# Altium project DRV8701_MOTOR_BOARD.PrjPcb
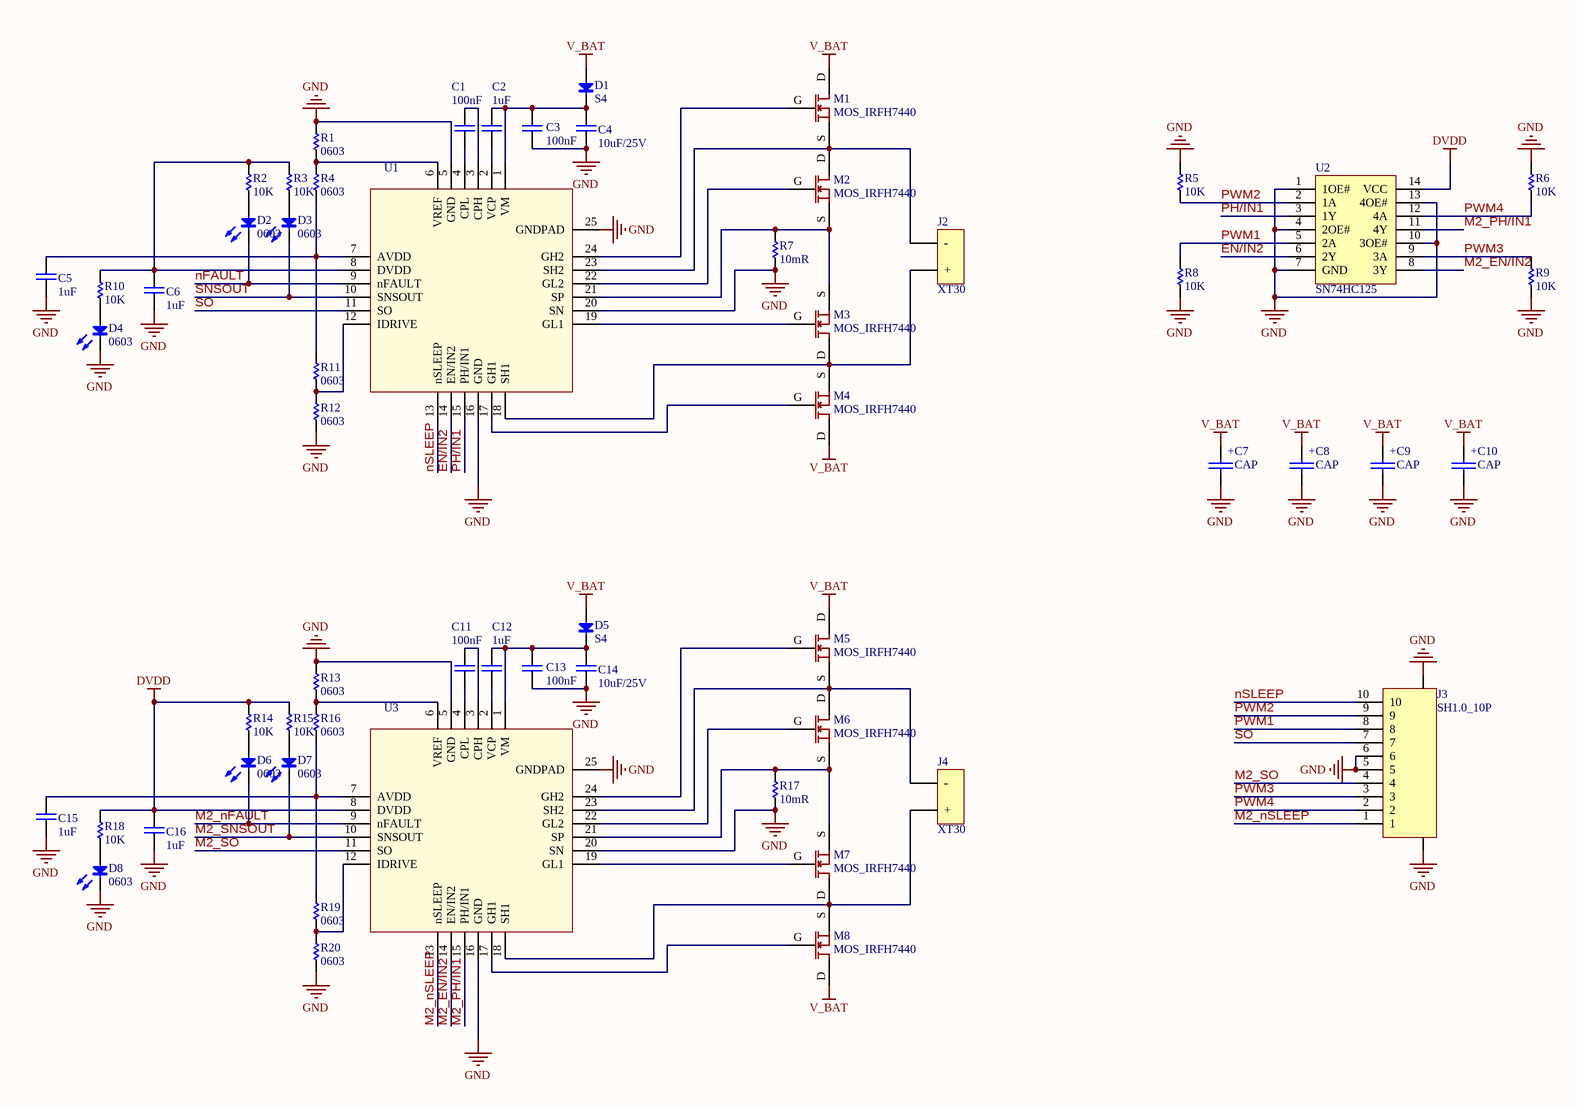
[diagram p0: Sheet1.SchDoc]
1 sheet, 58 parts. Net scope: global (net labels, ports and power ports of the same name join across sheets).
Board file: PCB1.PcbDoc

## Sheet Sheet1.SchDoc
size A3; SheetNumber: 1; SheetTotal: 1

### Parts
C1  100nF  [0603C]
C2  1uF  [0603C]
C3  100nF  [0603C]
C4  10uF/25V  [0805C]
C5  1uF  [0603C]
C6  1uF  [0603C]
C7  CAP  [CAP-8*11.5]
C8  CAP  [CAP-8*11.5]
C9  CAP  [CAP-8*11.5]
C10  CAP  [CAP-8*11.5]
C11  100nF  [0603C]
C12  1uF  [0603C]
C13  100nF  [0603C]
C14  10uF/25V  [0805C]
C15  1uF  [0603C]
C16  1uF  [0603C]
D1  S4  [SOD-123]
D2  0603  [0603-LED]
D3  0603  [0603-LED]
D4  0603  [0603-LED]
D5  S4  [SOD-123]
D6  0603  [0603-LED]
D7  0603  [0603-LED]
D8  0603  [0603-LED]
J2  XT30  [AMASS_XT30_M]
J3  SH1.0_10P  [SH1.0_10P]
J4  XT30  [AMASS_XT30_M]
M1  MOS_IRFH7440  [MOS_IRFH7440]
M2  MOS_IRFH7440  [MOS_IRFH7440]
M3  MOS_IRFH7440  [MOS_IRFH7440]
M4  MOS_IRFH7440  [MOS_IRFH7440]
M5  MOS_IRFH7440  [MOS_IRFH7440]
M6  MOS_IRFH7440  [MOS_IRFH7440]
M7  MOS_IRFH7440  [MOS_IRFH7440]
M8  MOS_IRFH7440  [MOS_IRFH7440]
R1  0603  [0603R]
R2  10K  [0603R]
R3  10K  [0603R]
R4  0603  [0603R]
R5  10K  [0603R]
R6  10K  [0603R]
R7  10mR  [2512R]
R8  10K  [0603R]
R9  10K  [0603R]
R10  10K  [0603R]
R11  0603  [0603R]
R12  0603  [0603R]
R13  0603  [0603R]
R14  10K  [0603R]
R15  10K  [0603R]
R16  0603  [0603R]
R17  10mR  [2512R]
R18  10K  [0603R]
R19  0603  [0603R]
R20  0603  [0603R]
U1  DRV8701  [DRV8701]  (value not drawn)
U2  SN74HC125  [TSSOP-14_L5.0-W4.4-P0.65-LS6.5-BL]
U3  DRV8701  [DRV8701]  (value not drawn)

### Nets
DVDD: C16.2 R14.1 R15.1 R18.1 U2.14(VCC) U3.8(DVDD)
GND: C3.2 C4.1 C5.2 C6.1 C7.2 C8.2 C9.2 C10.2 C13.2 C14.1 C15.2 C16.1 D4.2 D8.2 J3.5 J3.6 J3.11 J3.12 R1.2 R5.1 R6.2 R7.2 R8.2 R9.2 R12.2 R13.2 R17.2 R20.2 U1.5(GND) U1.16(GND) U1.20(SN) U1.25(GNDPAD) U2.1(1OE#) U2.4(2OE#) U2.7(GND) U2.10(3OE#) U2.13(4OE#) U3.5(GND) U3.16(GND) U3.20(SN) U3.25(GNDPAD)
V_BAT: C7.1 C8.1 C9.1 C10.1 D1.A D5.A M1.D M4.D M5.D M8.D
EN/IN2: U1.14(EN/IN2) U2.6(2Y)
M2_EN/IN2: U2.8(3Y) U3.14(EN/IN2)
M2_nFAULT: D6.2 U3.9(nFAULT)
M2_nSLEEP: J3.1 U3.13(nSLEEP)
M2_PH/IN1: U2.11(4Y) U3.15(PH/IN1)
M2_SNSOUT: D7.2 U3.10(SNSOUT)
M2_SO: J3.4 U3.11(SO)
nFAULT: D2.2 U1.9(nFAULT)
nSLEEP: J3.10 U1.13(nSLEEP)
PH/IN1: U1.15(PH/IN1) U2.3(1Y)
PWM1: J3.8 R8.1 U2.5(2A)
PWM2: J3.9 R5.2 U2.2(1A)
PWM3: J3.3 R9.1 U2.9(3A)
PWM4: J3.2 R6.1 U2.12(4A)
SNSOUT: D3.2 U1.10(SNSOUT)
SO: J3.7 U1.11(SO)
NetC1_1: C1.1 U1.3(CPH)
NetC1_2: C1.2 U1.4(CPL)
NetC2_1: C2.1 C3.1 C4.2 D1.K U1.1(VM)
NetC2_2: C2.2 U1.2(VCP)
NetC5_1: C5.1 R4.1 R11.1 U1.7(AVDD)
NetC6_2: C6.2 R2.1 R3.1 R10.1 U1.8(DVDD)
NetC11_1: C11.1 U3.3(CPH)
NetC11_2: C11.2 U3.4(CPL)
NetC12_1: C12.1 C13.1 C14.2 D5.K U3.1(VM)
NetC12_2: C12.2 U3.2(VCP)
NetC15_1: C15.1 R16.1 R19.1 U3.7(AVDD)
NetD2_1: D2.1 R2.2
NetD3_1: D3.1 R3.2
NetD4_1: D4.1 R10.2
NetD6_1: D6.1 R14.2
NetD7_1: D7.1 R15.2
NetD8_1: D8.1 R18.2
NetJ2_1: J2.1(+) M3.D M4.S U1.18(SH1)
NetJ2_2: J2.2(-) M1.S M2.D U1.23(SH2)
NetJ4_1: J4.1(+) M7.D M8.S U3.18(SH1)
NetJ4_2: J4.2(-) M5.S M6.D U3.23(SH2)
NetM1_G: M1.G U1.24(GH2)
NetM2_G: M2.G U1.22(GL2)
NetM2_S: M2.S M3.S R7.1 U1.21(SP)
NetM3_G: M3.G U1.19(GL1)
NetM4_G: M4.G U1.17(GH1)
NetM5_G: M5.G U3.24(GH2)
NetM6_G: M6.G U3.22(GL2)
NetM6_S: M6.S M7.S R17.1 U3.21(SP)
NetM7_G: M7.G U3.19(GL1)
NetM8_G: M8.G U3.17(GH1)
NetR1_1: R1.1 R4.2 U1.6(VREF)
NetR11_2: R11.2 R12.1 U1.12(IDRIVE)
NetR13_1: R13.1 R16.2 U3.6(VREF)
NetR19_2: R19.2 R20.1 U3.12(IDRIVE)

### Notes on the sheet
- (in symbol CAP) +

### Library data of the parts
C1-C3 C5 C6 C11-C13 C15 C16 = 0603-C
C4 C14 = 0805-C
C7-C10 = CAP: 插件电解电容
D1 D5 = DIODE-SOD123: 二极管
D2-D4 D6-D8 = 0603-LED: Designer: www.dratk.com
J2 J4 = AMASS_XT30_M: XT30_M
M1-M8 = MOS_IRFH7440: NMOS
R1-R6 R8-R16 R18-R20 = 0603-R
R7 R17 = 2512-R
U2 = SN74HC125: TI, 2-6V